# Altium project LM25119_EVB.PrjPCB
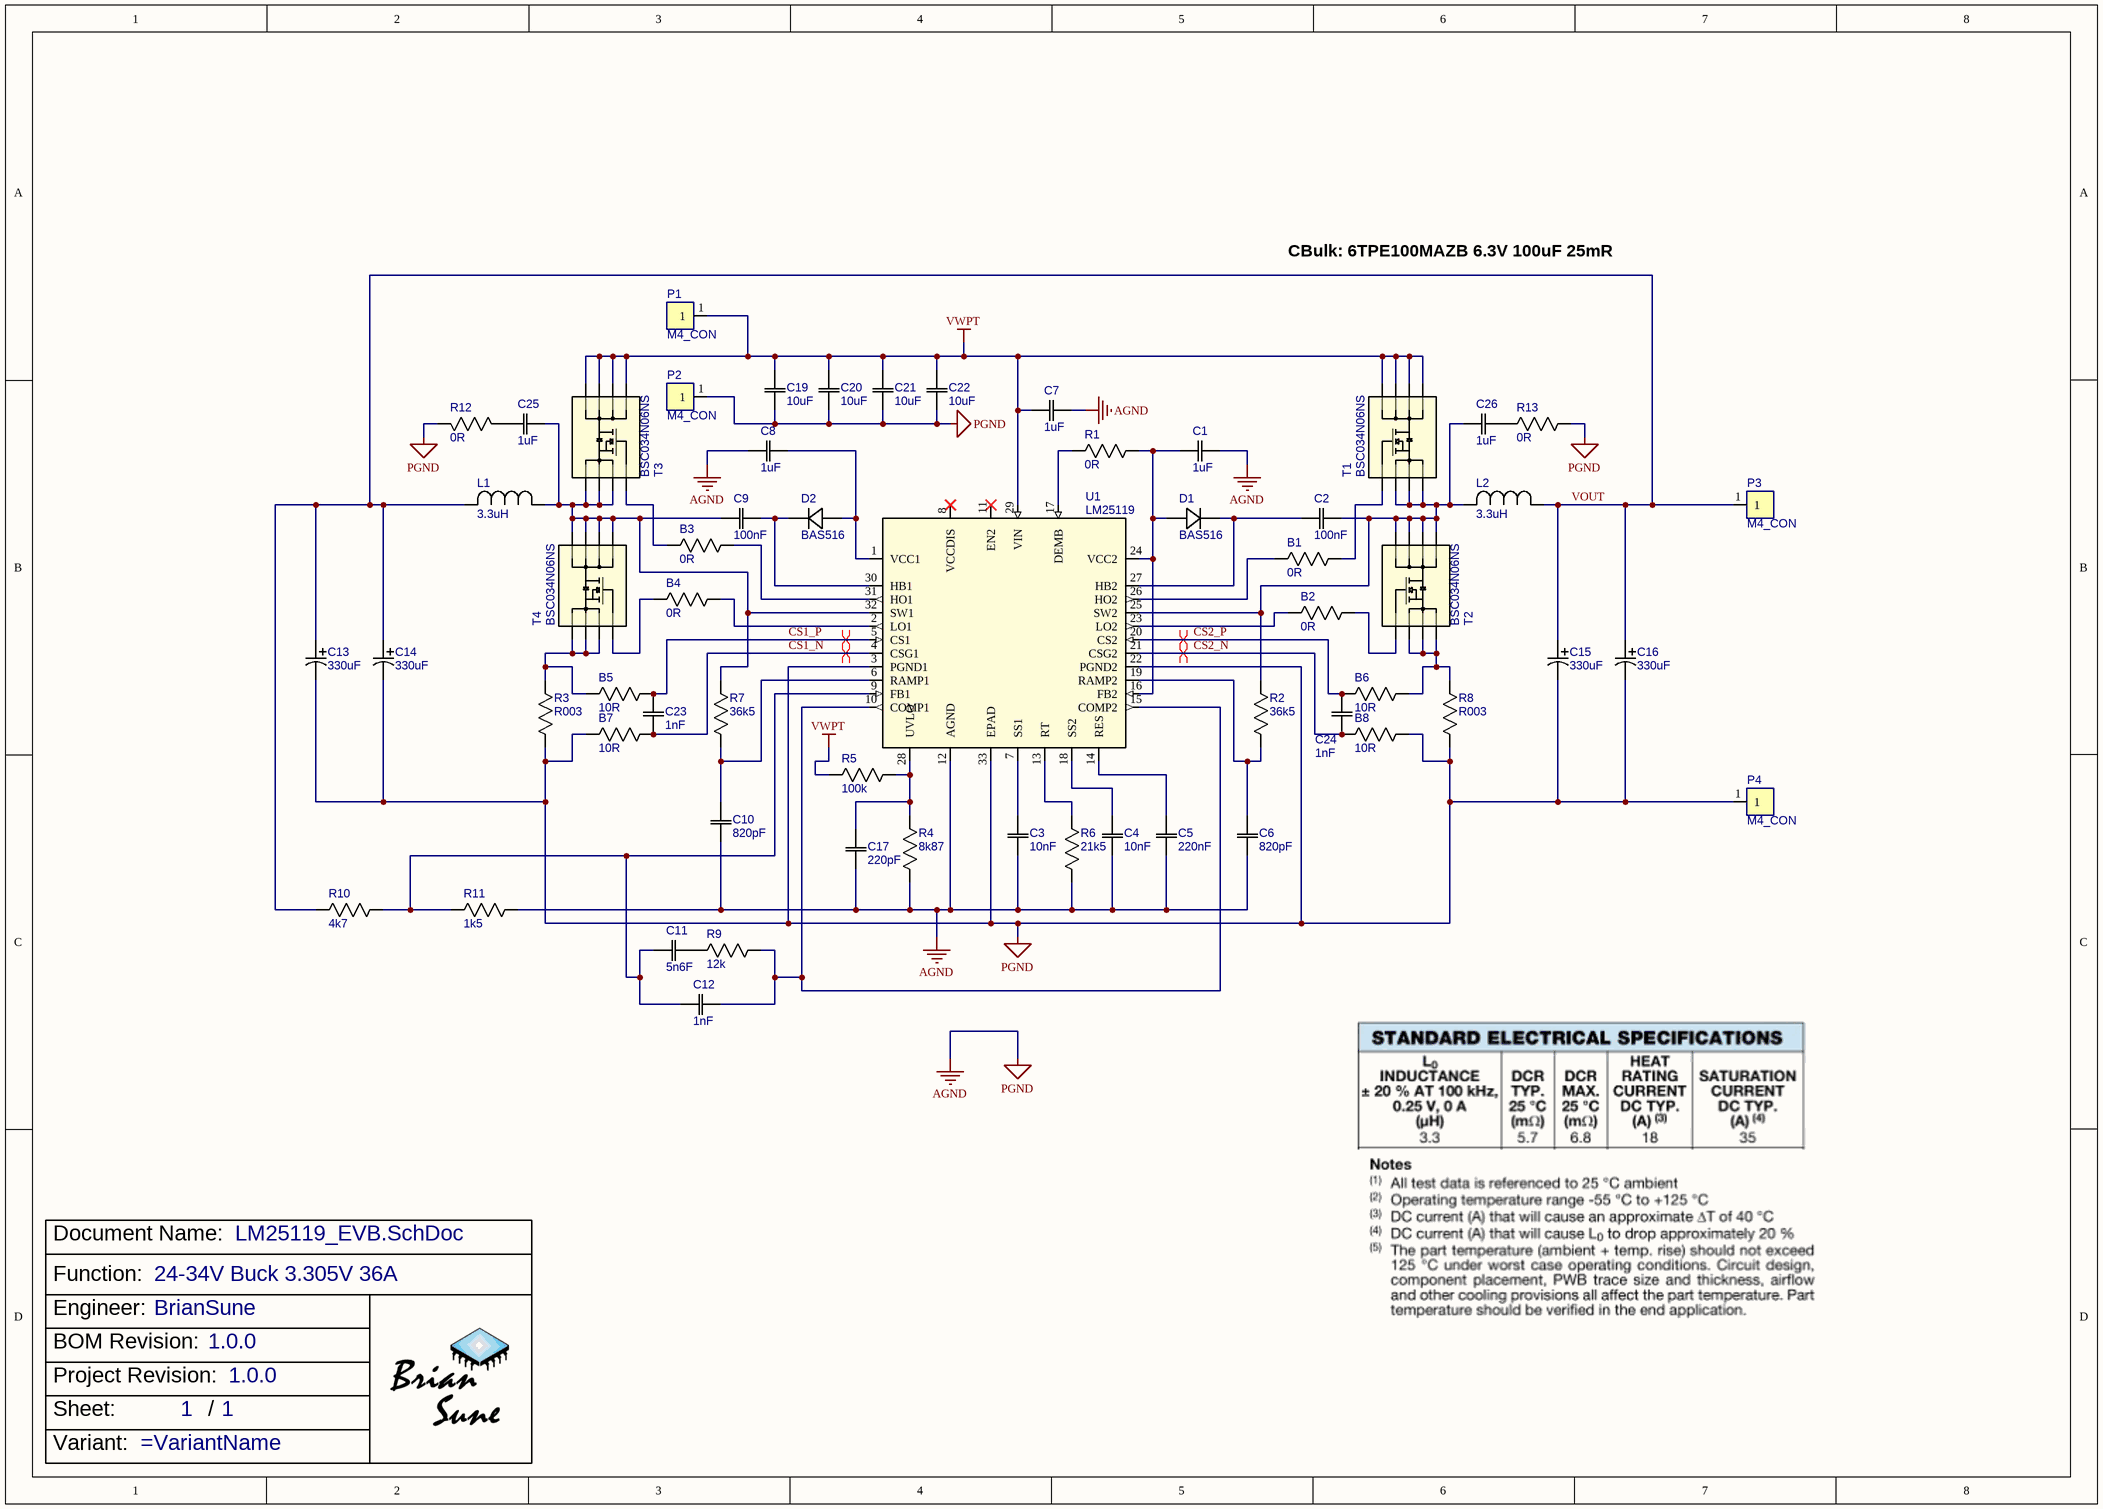
[diagram p0: LM25119_EVB.SchDoc]
BOMRevision: 1.0.0; EngineerName: BrianSune; ProjectRevision: 1.0.0
1 sheet, 60 parts. Net scope: global (net labels, ports and power ports of the same name join across sheets).
Board file: LM25119_EVB.PcbDoc

## Sheet LM25119_EVB.SchDoc
size A3; DocumentNumber: 1; SheetNumber: 1; SheetTotal: 1

### Parts
?  Function: 24-34V Buck 3.305V 36A  (hidden comment: TitleBlock)  (graphical)
B1  0R  [0603]
B2  0R  [0603]
B3  0R  [0603]
B4  0R  [0603]
B5  10R  [0603]
B6  10R  [0603]
B7  10R  [0603]
B8  10R  [0603]
C1  1uF  [C0603]
C2  100nF  [C0603]
C3  10nF  [0402]
C4  10nF  [0402]
C5  220nF  [0402]
C6  820pF  [0402]
C7  1uF  [C0603]
C8  1uF  [C0603]
C9  100nF  [C0603]
C10  820pF  [0402]
C11  5n6F  [0402]
C12  1nF  [0402]
C13  330uF  [7343]
C14  330uF  [7343]
C15  330uF  [7343]
C16  330uF  [7343]
C17  220pF  [0402]
C19  10uF  [1210]
C20  10uF  [1210]
C21  10uF  [1210]
C22  10uF  [1210]
C23  1nF  [0402]
C24  1nF  [0402]
C25  1uF  [C0603]
C26  1uF  [C0603]
D1  BAS516  [SOD-523]
D2  BAS516  [SOD-523]
L1  3.3uH  [L126X]
L2  3.3uH  [L126X]
P1  M4_CON  [PCBComponent_1]
P2  M4_CON  [PCBComponent_1]
P3  M4_CON  [PCBComponent_1]
P4  M4_CON  [PCBComponent_1]
R1  0R  [0402]
R2  36k5  [0402]
R3  R003  [R2512]
R4  8k87  [0402]
R5  100k  [0402]
R6  21k5  [0402]
R7  36k5  [0402]
R8  R003  [R2512]
R9  12k  [0402]
R10  4k7  [0402]
R11  1k5  [0402]
R12  0R  [0603]
R13  0R  [0603]
T1  BSC034N06NS  [PQFNWB5x6]
T2  BSC034N06NS  [PQFNWB5x6]
T3  BSC034N06NS  [PQFNWB5x6]
T4  BSC034N06NS  [PQFNWB5x6]
U1  LM25119  [WQFN32]

### Nets
AGND: B7.1 B8.2 C1.2 C3.1 C4.1 C5.1 C6.1 C7.2 C8.2 C10.1 C13.2 C14.2 C15.2 C16.2 C17.1 C19.1 C20.1 C21.1 C22.1 P2.1 P4.1 R3.1 R4.1 R6.1 R8.1 R11.1 R12.2 R13.2 U1.3(PGND1) U1.12(AGND) U1.22(PGND2) U1.33(EPAD)  [also labelled PGND]
VWPT: C7.1 C19.2 C20.2 C21.2 C22.2 P1.1 R5.2 T1.5 T1.6 T1.7 T1.8 T3.5 T3.6 T3.7 T3.8 U1.29(VIN)
CS1_N: B7.2 C23.2 U1.4(CSG1)
CS1_P: B5.2 C23.1 U1.5(CS1)
CS2_N: B8.1 C24.2 U1.21(CSG2)
CS2_P: B6.1 C24.1 U1.20(CS2)
VOUT: C13.1 C14.1 C15.1 C16.1 L1.2 L2.1 P3.1 R10.1
NetB1_1: B1.1 U1.26(HO2)
NetB1_2: B1.2 T1.4
NetB2_1: B2.1 U1.23(LO2)
NetB2_2: B2.2 T2.4
NetB3_1: B3.1 T3.4
NetB3_2: B3.2 U1.31(HO1)
NetB4_1: B4.1 T4.4
NetB4_2: B4.2 U1.2(LO1)
NetB5_1: B5.1 R3.2 T4.1 T4.2 T4.3
NetB6_2: B6.2 R8.2 T2.1 T2.2 T2.3
NetC1_1: C1.1 D1.2 R1.1 U1.16(FB2) U1.24(VCC2)
NetC2_1: C2.1 D1.1 U1.27(HB2)
NetC2_2: C2.2 C26.1 L2.2 R2.2 T1.1 T1.2 T1.3 T2.5 T2.6 T2.7 T2.8 U1.25(SW2)
NetC3_2: C3.2 U1.7(SS1)
NetC4_2: C4.2 U1.18(SS2)
NetC5_2: C5.2 U1.14(RES)
NetC6_2: C6.2 R2.1 U1.19(RAMP2)
NetC8_1: C8.1 D2.2 U1.1(VCC1)
NetC9_1: C9.1 D2.1 U1.30(HB1)
NetC9_2: C9.2 C25.1 L1.1 R7.2 T3.1 T3.2 T3.3 T4.5 T4.6 T4.7 T4.8 U1.32(SW1)
NetC10_2: C10.2 R7.1 U1.6(RAMP1)
NetC11_1: C11.1 R9.2
NetC11_2: C11.2 C12.2 R10.2 R11.2 U1.9(FB1)
NetC12_1: C12.1 R9.1 U1.10(COMP1) U1.15(COMP2)
NetC17_2: C17.2 R4.2 R5.1 U1.28(UVLO)
NetC25_2: C25.2 R12.1
NetC26_2: C26.2 R13.1
NetR1_2: R1.2 U1.17(DEMB)
NetR6_2: R6.2 U1.13(RT)

Not connected (* = marked no-connect by the designer): U1 8(VCCDIS)* 11(EN2)*

### Layout directives
differential pair: CS1_N, CS1_P, CS2_N, CS2_P

### Notes on the sheet
- CBulk: 6TPE100MAZB 6.3V 100uF 25mR
- (in symbol TitleBlock) Document Name:; Function:; Engineer:; BOM Revision:; Project Revision:; Sheet:; /; Variant:

### Library data of the parts
B1-B4 R12 R13 = 0R: 0R 1/10W +/-1%; Mfr.: UNIOHM; Mfr. No: 0R; Price: 0.016; ComponentLink1Description: taobao; ComponentLink1URL: https://item.taobao.com/item.htm?spm=a1z10.3-c-s.w4002-24706531953.10.66736a4boyPN1N&id=584519288165
B5-B8 = ARG03DTC0100: 10R 1/10W +/-0.5%; Mfr.: Viking; Mfr. No: ARG03DTC0100; Price: 0.044; ComponentLink1Description: taobao; ComponentLink1URL: https://item.taobao.com/item.htm?spm=a1z09.2.0.0.6e162e8dlKCeMq&id=632526730087&_u=c10quk0k836f
C1 C7 C8 C25 C26 = OUDEIBUN_1uF: 0603 1UF 16V 10% 105K X5R; ComponentLink1Description: taobao; ComponentLink1URL: https://detail.tmall.com/item.htm?abbucket=11&id=610883455002&rn=96f7b0dde361d4c3b62eb7ab1af2da05&skuId=4292434832790&spm=a1z10.3-b.w4011-22147617817.48.46817d1eD6aiZS; Mfr.: OUDEIBUN; Mfr. No: 105K; Price: 0.03
C2 C9 = OUDEIBUN_100nF: 0603 100NF 50V 10% 104K X7R; ComponentLink1Description: taobao; ComponentLink1URL: https://detail.tmall.com/item.htm?_u=p10quk0k2f35&id=610651934672&spm=a1z09.2.0.0.77b12e8d9iVia0&skuId=4463522550238; Mfr.: OUDEIBUN; Mfr. No: 104K; Price: 0.025
C3 C4 = OBEIDUN_10nF: 0402 103K 10NF 50V 10% X7R; ComponentLink1Description: taobao; ComponentLink1URL: https://detail.tmall.com/item.htm?abbucket=13&id=609908732147&rn=bb3a3ed3a866563628ab102252a3ac61&spm=a1z10.3-b.w4011-22147617817.34.3bed7d1eYI03Bg&skuId=4289502284285; Mfr.: OBEIDUN; Mfr. No: 103K; Price: 0.015
C5 = OBEIDUN_220nF: 0402 220nF 224K  50V X7R; ComponentLink1Description: taobao; ComponentLink1URL: https://detail.tmall.com/item.htm?abbucket=11&id=610639075445&rn=c45cf579a90ea6adc9060b093ff18dcd&skuId=4463795831944&spm=a312a.7700824.w4011-22147617817.53.51a47d1eimiUpx; Mfr.: OBEIDUN; Mfr. No: 224K; Price: 0.03
C6 C10 = OBEIDUN_680pF: 680pF 50V 100V +/-5% 681J COG; ComponentLink1Description: taobao; ComponentLink1URL: https://detail.tmall.com/item.htm?abbucket=13&id=609631499278&rn=f5bd684ac3f51c46f888ad99ccd96ebe&spm=a1z10.3-b.w4011-22147617817.52.66d87d1eD7edtj&skuId=4450047134670; Mfr.: OBEIDUN; Mfr. No: 681J; Price: 0.02
C11 = OBEIDUN_5n6F: 0402 562K 5.6NF 50V X7R; ComponentLink1Description: taobao; ComponentLink1URL: https://detail.tmall.com/item.htm?_u=i10quk0kb5ea&id=609907244741&spm=a1z09.2.0.0.485e2e8ddN1cee; Mfr.: OBEIDUN; Mfr. No: 562K; Price: 0.015
C12 = OBEIDUN_22pF: 0402 22pF 50V 20J COG NPO; Mfr. No: 220J; ComponentLink1Description: taobao; ComponentLink1URL: https://detail.tmall.com/item.htm?abbucket=13&id=609430597564&rn=a1c8a15a7d6b2f90e38db74694a5b856&spm=a1z10.3-b.w4011-22147617817.40.15037d1etTZYEz&skuId=4280449596223; Mfr.: OBEIDUN; Price: 0.02
C13-C16 = 6TPF330M9L: 6TPF330M9L 330UF 6.3V D Type; Mfr.: Panasonic; Mfr. No: 6TPF330M9L; ComponentLink1Description: taobao; ComponentLink1URL: https://detail.tmall.com/item.htm?id=675742361610&spm=a1z0d.6639537/tb3.1997196601.4.3f437484l6zfPv; Price: 2.5
C17 = OBEIDUN_220pF: OBEIDUN 0402 221J COG 50V; ComponentLink1Description: taobao; ComponentLink1URL: https://detail.tmall.com/item.htm?_u=l10quk0k03aa&id=608895064566&spm=a1z09.2.0.0.10c82e8dL5BzWq&skuId=4453182071791; Mfr.: OBEIDUN; Mfr. No: 221J; Price: 0.02
C19-C22 = OUBEIDUN_106_X7R: 1210 10UF 106K 100V X7R; Mfr. No: 10uF/100V; Mfr.: OUBEIDUN; Price: 0.6; ComponentLink1Description: taobao; ComponentLink1URL: https://detail.tmall.com/item.htm?_u=q10quk0k91e6&id=610720536810&spm=a1z09.2.0.0.680e2e8dgSrizI&skuId=4470822090146
C23 C24 = RAINPOLE_2n2F: RAINPOLE 0402 2.2nF 5% 50V NPO; Mfr. No: 222J; ComponentLink1Description: taobao; ComponentLink1URL: https://detail.tmall.com/item.htm?abbucket=11&id=577480004200&rn=e81fc7a7675914d6e9f82eba46a12cbb&skuId=3986690931935&spm=a1z10.3-b-s.w4011-12364813249.37.6d9c1ed6XWLE9d; Mfr.: RAINPOLE; Price: 0.04
D1 D2 = OBEIDUN_BAS516: SOD-523 100V/250mA; Mfr. No: BAS516,61; Mfr.: OBEIDUN; ComponentLink1Description: taobao; ComponentLink1URL: https://detail.tmall.com/item.htm?abbucket=11&id=627344864030&rn=9e03fb0dc0c82be40d648479edaa9265&skuId=4457291933929&spm=a1z10.3-b.w4011-22147617817.46.572e7d1eRfO8kn; Price: 0.14
L1 L2 = L1260_332: HC1260 3R3M; Mfr.: Xing Guangzhou; Mfr. No: HC1260_3R3; Price: 1.2; ComponentLink1Description: taobao; ComponentLink1URL: https://item.taobao.com/item.htm?spm=a1z09.2.0.0.57072e8dYkUt8H&id=10840816607&_u=410quk0k837d
P1-P4 = M4_CON: Mfr.: LFX; Mfr. No: PCB-10-4; ComponentLink1Description: taobao; ComponentLink1URL: https://item.taobao.com/item.htm?spm=a1z09.2.0.0.45712e8dxvwLo5&id=531030902005&_u=s10quk0k994a; Price: 0.41
R1 = OUDEIBUN_0R: OUDEIBUN / 0R 1% 1/16W; ComponentLink1Description: taobao; ComponentLink1URL: https://detail.tmall.com/item.htm?abbucket=11&id=609078082053&rn=dd22835191e181ef543cf6f0827e8de3&spm=a1z10.3-b.w4011-22147617817.40.1e787d1eBkSpf5&skuId=4447040574382; Mfr.: OUDEIBUN; Mfr. No: 0R; Price: 0.02
R2 R7 = OUDEIBUN_36k5: OUDEIBUN / 36k5 1% 1/16W; ComponentLink1Description: taobao; ComponentLink1URL: https://detail.tmall.com/item.htm?abbucket=11&id=656599902463&rn=b271eb3836211a3eb1da72e116a619f1&skuId=4912168475534&spm=a1z10.3-b.w4011-22147617817.19.bd537d1eRNyfmb; Mfr.: OUDEIBUN; Mfr. No: 36k5; Price: 0.02
R3 R8 = OUDEIBUN_R003: OUDEIBUN / 2W 0.003R +/-1%; Mfr.: OUDEIBUN; ComponentLink1Description: taobao; ComponentLink1URL: https://detail.tmall.com/item.htm?abbucket=11&id=607939756288&rn=a98d1040de4f4962c72f4eee3717b5a4&spm=a1z10.3-b.w4011-22147617817.28.6a7a7d1eCVFt1r&skuId=4272437489559; Price: 0.33; Mfr. No: R003
R4 = UNIOHM_8k87: UNIOHM / 8k87 1% 1/16W; Mfr. No: 0402WGF8871TCE; ComponentLink1Description: taobao; ComponentLink1URL: https://item.taobao.com/item.htm?spm=a1z09.2.0.0.526a2e8dtHz0un&id=605027116229&_u=110quk0kf99f; Mfr.: UNIOHM; Price: 0.012
R5 = UNIOHM_100k: UNIOHM / 1% 100k; ComponentLink1Description: taobao; ComponentLink1URL: https://item.taobao.com/item.htm?spm=a1z09.2.0.0.44de2e8d3IDpt5&id=525633701805&_u=o10quk0k9fd0; Mfr.: UNIOHM; Mfr. No: 100k; Price: 0.012
R6 = OUDEIBUN_21k5: OUDEIBUN / 21k5 1% 1/16W; ComponentLink1Description: taobao; ComponentLink1URL: https://detail.tmall.com/item.htm?_u=310quk0k3cbb&id=656218957556&spm=a1z09.2.0.0.d5442e8dvaKsoM&skuId=4912158475130; Mfr.: OUDEIBUN; Mfr. No: 21k5; Price: 0.02
R9 = OUDEIBUN_12k: OUDEIBUN / 12k 1% 1/16W; ComponentLink1Description: taobao; ComponentLink1URL: https://detail.tmall.com/item.htm?abbucket=11&id=655765932456&rn=02d1aad3326fb9002d0e9ee11440ad53&skuId=4733468228268&spm=a1z10.3-b.w4011-22147617817.23.a0227d1efWkiz2; Mfr.: OUDEIBUN; Mfr. No: 12k; Price: 0.02
R10 = OUDEIBUN_4k7: OUDEIBUN / 4k7 1% 1/16W; ComponentLink1Description: taobao; ComponentLink1URL: https://detail.tmall.com/item.htm?abbucket=11&id=609306247616&rn=b12b173379d08c9da521548aa8f3873c&spm=a1z10.3-b.w4011-22147617817.66.27437d1eyVjB3l&skuId=4279727269027; Mfr.: OUDEIBUN; Mfr. No: 4k7; Price: 0.02
R11 = OUDEIBUN_1k5: OUDEIBUN / 1% 1k5; ComponentLink1Description: taobao; ComponentLink1URL: https://detail.tmall.com/item.htm?abbucket=11&id=609080898470&rn=e8ac5f428b57ca8c5f4fd2285344b596&spm=a1z10.3-b.w4011-22147617817.56.4da07d1eK35JhM&skuId=4276063084040; Mfr.: OUDEIBUN; Mfr. No: 1k5; Price: 0.02
T1-T4 = BSC034N06NS: MPower Transistor, 60V; Mfr.: Infineon Technologies; Mfr. No: BSC034N06NS; ComponentLink1Description: taobao; ComponentLink1URL: https://detail.tmall.com/item.htm?abbucket=12&id=712516353118&ns=1&spm=a21n57.1.0.0.5a70523ceCAuo0&skuId=4992670365636; Price: 4.5
U1 = LM25119: Wide Input Range, Dual Synchronous Buck Controller; Mfr.: Texas Instruments; Mfr. No: LM25119PSQ; Price: 10.0; ComponentLink1Description: taobao; ComponentLink1URL: https://item.taobao.com/item.htm?spm=a1z09.2.0.0.57392e8dDftXgF&id=750183520652&_u=110quk0kdafb

## Assembly variants
Default: not fitted C12 C25 C26 R1 R12 R13